# EAGLE design dummyload (EAGLE 6.3)
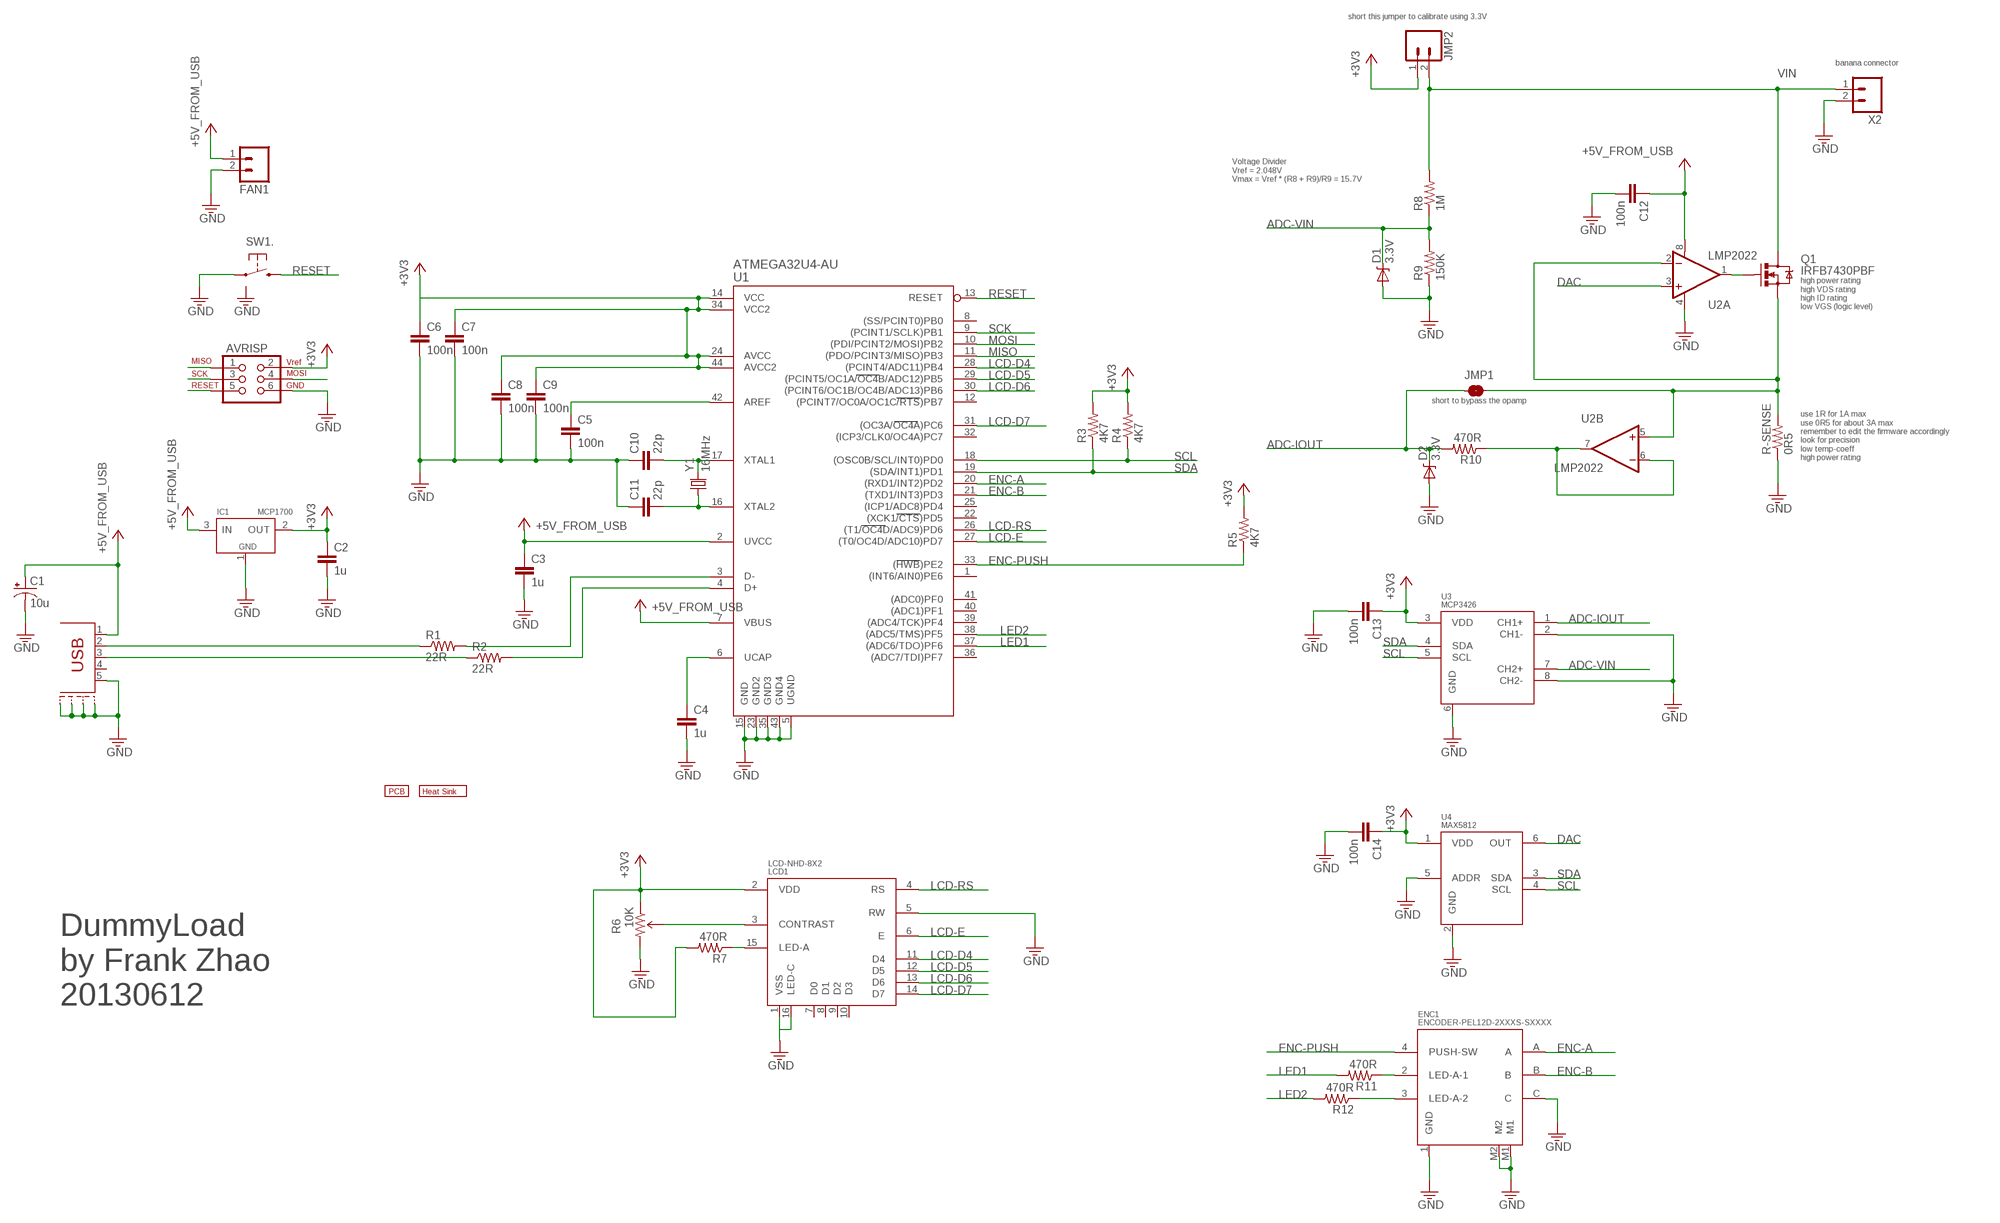
[diagram p0: schematic, sheet 1]

## Parts
AVRISP  AVR_SPI_PRG_62X3_LOCK  [2X3_LOCK]
C1  10u  CAP_POL1206-KIT  [EIA3216-KIT]
C2  1u  CAP0603-CAP  [0603-CAP]
C3  1u  CAP0603-CAP  [0603-CAP]
C4  1u  CAP0603-CAP  [0603-CAP]
C5  100n  CAP0603-CAP  [0603-CAP]
C6  100n  CAP0603-CAP  [0603-CAP]
C7  100n  CAP0603-CAP  [0603-CAP]
C8  100n  CAP0603-CAP  [0603-CAP]
C9  100n  CAP0603-CAP  [0603-CAP]
C10  22p  CAP0603-CAP  [0603-CAP]
C11  22p  CAP0603-CAP  [0603-CAP]
C12  100n  CAP0603-CAP  [0603-CAP]
C13  100n  CAP0603-CAP  [0603-CAP]
C14  100n  CAP0603-CAP  [0603-CAP]
D1  3.3V  DIODE-ZENER-SOD-123  [SOD-123]
D2  3.3V  DIODE-ZENER-SOD-123  [SOD-123]
ENC1  ENCODER-PEL12D-2XXXS-SXXXX  [ENCODER-PEL12D-2XXXS-SXXXX]
FAN1  M02PTH  [1X02]
IC1  MCP1700  VREG-MCP1700-SOT23-3  [SOT23-3]
JMP1  SOLDERJUMPERNO  [SJ_2S-NO]
JMP2  M02-2MM  [1X02_2MM]
LCD1  LCD-NHD-8X2  [LCD-NHD-8X2-HEADER]
Q1  IRFB7430PBF  MOSFET-NCHANNELPTH2  [TO220V]
R1  22R  RESISTOR0603-RES  [0603-RES]
R2  22R  RESISTOR0603-RES  [0603-RES]
R3  4K7  RESISTOR0603-RES  [0603-RES]
R4  4K7  RESISTOR0603-RES  [0603-RES]
R5  4K7  RESISTOR0603-RES  [0603-RES]
R6  10K  TRIMPOTSMD  [TRIMPOT-3MM]
R7  470R  RESISTOR0603-RES  [0603-RES]
R8  1M  RESISTOR0603-RES  [0603-RES]
R9  150K  RESISTOR0603-RES  [0603-RES]
R10  470R  RESISTOR0603-RES  [0603-RES]
R11  470R  RESISTOR0603-RES  [0603-RES]
R12  470R  RESISTOR0603-RES  [0603-RES]
R-SENSE  0R5  RESISTOR-D2PAK  [D2PACK]
SW1  SWITCH-B3U-1110-BOSS  [SWITCH-TACT-B3U-1100P-B]
U1  ATMEGA32U4-AU  [TQFP44]
U2  LMP2022  LMP20X2-MSOP8  [MSOP-8]
U3  MCP3426  MCP3426-MSOP8  [MSOP-8]
U4  MAX5812  MAX5812-SOT-23-6  [SOT23-6]
U$1  PCB-HAMMOND-RL6115  [PCB-HAMMOND-RL6115]
U$2  HEATSINK-TO220-VERT-42X25.4  [HEATSINK-TO220-VERT-42X25.4]
X1  USB-MINI/MICRO-4S-4LEGS  [USB_MICROB_4LEGS]
X2  M025MM  [SCREWTERMINAL-5MM-2]
Y1  16MHz  CRYSTAL5X3  [CRYSTAL-SMD-5X3]

## Nets
+3V3: AVRISP.2 C2.1 C6.1 C7.1 C8.1 C9.1 C13.1 C14.1 IC1.2(OUT) JMP2.1 LCD1.2(VDD) R3.2 R4.2 R5.2 R6.1(CCW) R7.2 U1.14(VCC) U1.24(AVCC) U1.34(VCC2) U1.44(AVCC2) U3.3(VDD) U4.1(VDD)
+5V_FROM_USB: C1.A(+) C3.1 C12.1 FAN1.1 IC1.3(IN) U1.2(UVCC) U1.7(VBUS) U2.8(A:V+) X1.1(VBUS)
ADC-IOUT: D2.C JMP1.1 R10.2 U3.1(CH1+)
ADC-VIN: D1.C R8.1 R9.2 U3.7(CH2+)
DAC: U2.3(A:+IN) U4.6(OUT)
ENC-A: ENC1.A U1.20((RXD1/INT2)PD2)
ENC-B: ENC1.B U1.21((TXD1/INT3)PD3)
ENC-PUSH: ENC1.4(PUSH-SW) R5.1 U1.33((HWB)PE2)
GND: AVRISP.6 C1.C(-) C2.2 C3.2 C4.2 C5.2 C6.2 C7.2 C8.2 C9.2 C10.1 C11.1 C12.2 C13.2 C14.2 D1.A D2.A ENC1.1(GND) ENC1.C ENC1.M1 ENC1.M2 FAN1.2 IC1.1(GND) LCD1.1(VSS) LCD1.5(RW) LCD1.16(LED-C) R6.3(CW) R9.1 R-SENSE.1 SW1.1 SW1.BOSS U1.5(UGND) U1.15(GND) U1.23(GND2) U1.35(GND3) U1.43(GND4) U2.4(A:V-) U3.2(CH1-) U3.6(GND) U3.8(CH2-) U4.2(GND) U4.5(ADDR) X1.5(GND) X1.P$3 X1.P$4 X1.P$7 X1.P$8 X2.2
LCD-D4: LCD1.11(D4) U1.28((PCINT4/ADC11)PB4)
LCD-D5: LCD1.12(D5) U1.29((PCINT5/OC1A/OC4B/ADC12)PB5)
LCD-D6: LCD1.13(D6) U1.30((PCINT6/OC1B/OC4B/ADC13)PB6)
LCD-D7: LCD1.14(D7) U1.31((OC3A/OC4A)PC6)
LCD-E: LCD1.6(E) U1.27((T0/OC4D/ADC10)PD7)
LCD-RS: LCD1.4(RS) U1.26((T1/OC4D/ADC9)PD6)
LED1: R11.2 U1.37((ADC6/TDO)PF6)
LED2: R12.2 U1.38((ADC5/TMS)PF5)
MISO: AVRISP.1 U1.11((PDO/PCINT3/MISO)PB3)
MOSI: AVRISP.4 U1.10((PDI/PCINT2/MOSI)PB2)
N$1: C4.1 U1.6(UCAP)
N$2: LCD1.15(LED-A) R7.1
N$3: C10.2 U1.17(XTAL1) Y1.3
N$4: LCD1.3(CONTRAST) R6.2(WIPER)
N$5: R1.1 X1.2(DM)
N$6: R2.1 X1.3(DP)
N$7: C11.2 U1.16(XTAL2) Y1.1
N$8: C5.1 U1.42(AREF)
N$9: JMP1.2 Q1.3(S) R-SENSE.3 U2.2(A:-IN) U2.5(B:+IN)
N$11: R1.2 U1.3(D-)
N$12: R2.2 U1.4(D+)
N$13: R10.1 U2.6(B:-IN) U2.7(B:OUT)
N$14: Q1.1(G) U2.1(A:OUT)
N$15: ENC1.2(LED-A-1) R11.1
N$16: ENC1.3(LED-A-2) R12.1
RESET: AVRISP.5 SW1.2 U1.13(RESET)
SCK: AVRISP.3 U1.9((PCINT1/SCLK)PB1)
SCL: R4.1 U1.18((OSC0B/SCL/INT0)PD0) U3.5(SCL) U4.4(SCL)
SDA: R3.1 U1.19((SDA/INT1)PD1) U3.4(SDA) U4.3(SDA)
VIN: JMP2.2 Q1.2(D) R8.2 X2.1
Unconnected: LCD1.7(D0) LCD1.8(D1) LCD1.9(D2) LCD1.10(D3) U1.1((INT6/AIN0)PE6) U1.8((SS/PCINT0)PB0) U1.12((PCINT7/OC0A/OC1C/RTS)PB7) U1.22((XCK1/CTS)PD5) U1.25((ICP1/ADC8)PD4) U1.32((ICP3/CLK0/OC4A)PC7) U1.36((ADC7/TDI)PF7) U1.39((ADC4/TCK)PF4) U1.40((ADC1)PF1) U1.41((ADC0)PF0) X1.4(ID)

## Notes on the sheet
- short this jumper to calibrate using 3.3V
- banana connector
- Voltage Divider
  Vref = 2.048V
  Vmax = Vref * (R8 + R9)/R9 = 15.7V
- high power rating
  high VDS rating
  high ID rating
  low VGS (logic level)
- short to bypass the opamp
- use 1R for 1A max
  use 0R5 for about 3A max
  remember to edit the firmware accordingly
  look for precision
  low temp-coeff
  high power rating
- DummyLoad
  by Frank Zhao
  20130612

## Library data of the parts
AVRISP = minilab:AVR_SPI_PRG_6: AVR ISP 6 Pin This is the reduced ISP connector for AVR programming. Common on Arduino. This footprint will take up less PCB space and can be used with a 10-pin to 6-pin adapter such as SKU: BOB-08508
C1 = minilab:CAP_POL: Capacitor Polarized These are standard SMD and PTH capacitors. Normally 10uF, 47uF, and 100uF in electrolytic and tantalum varieties. Always verify the external diameter of the through hole cap, it varies with capacity, voltage, and manufacturer. The EIA devices should be standard.
C2-C14 = minilab:CAP: Capacitor Standard 0603 ceramic capacitor, and 0.1" leaded capacitor.
D1 D2 = minilab:DIODE-ZENER: Zener Diode Production Part - 8199 3.4V Zener Voltage
ENC1 = minilab:ENCODER-PEL12D
FAN1 JMP2 X2 = minilab:M02: Header 2 Standard 2-pin 0.1" header. Use with straight break away headers (SKU : PRT-00116), right angle break away headers (PRT-00553), swiss pins (PRT-00743), machine pins (PRT-00117), and female headers (PRT-00115). Molex polarized connector foot print use with SKU : PRT-08233 with associated crimp pins and housings.
IC1 = minilab:VREG-MCP1700
JMP1 = minilab:SOLDERJUMPER: Solder Jumper Standard SMD solder jumper. Used to automate production. Two varients : Normally Open and Normally Closed are the same, but have different paste layers. NC will have a large amount of paste and should jumper during reflow.
LCD1 = minilab:LCD-NHD-8X2
Q1 = minilab:MOSFET-NCHANNEL
R1-R5 R7-R12 R-SENSE = minilab:RESISTOR: Resistor Basic schematic elements and footprints for 0603, 1206, and PTH resistors.
R6 = minilab:TRIMPOT
SW1 = minilab:SWITCH-B3U-1110
U1 = minilab:ATMEGA32U4-AU
U2 = minilab:LMP20X2
U3 = minilab:MCP3426
U4 = minilab:MAX5812
U$1 = minilab:PCB
U$2 = minilab:HEATSINK
X1 = minilab:USB-MINI/MICRO-4S
Y1 = minilab:CRYSTAL: Crystals Various standard crystals. Proven footprints. Spark Fun Electronics SKU : COM-00534

## Board
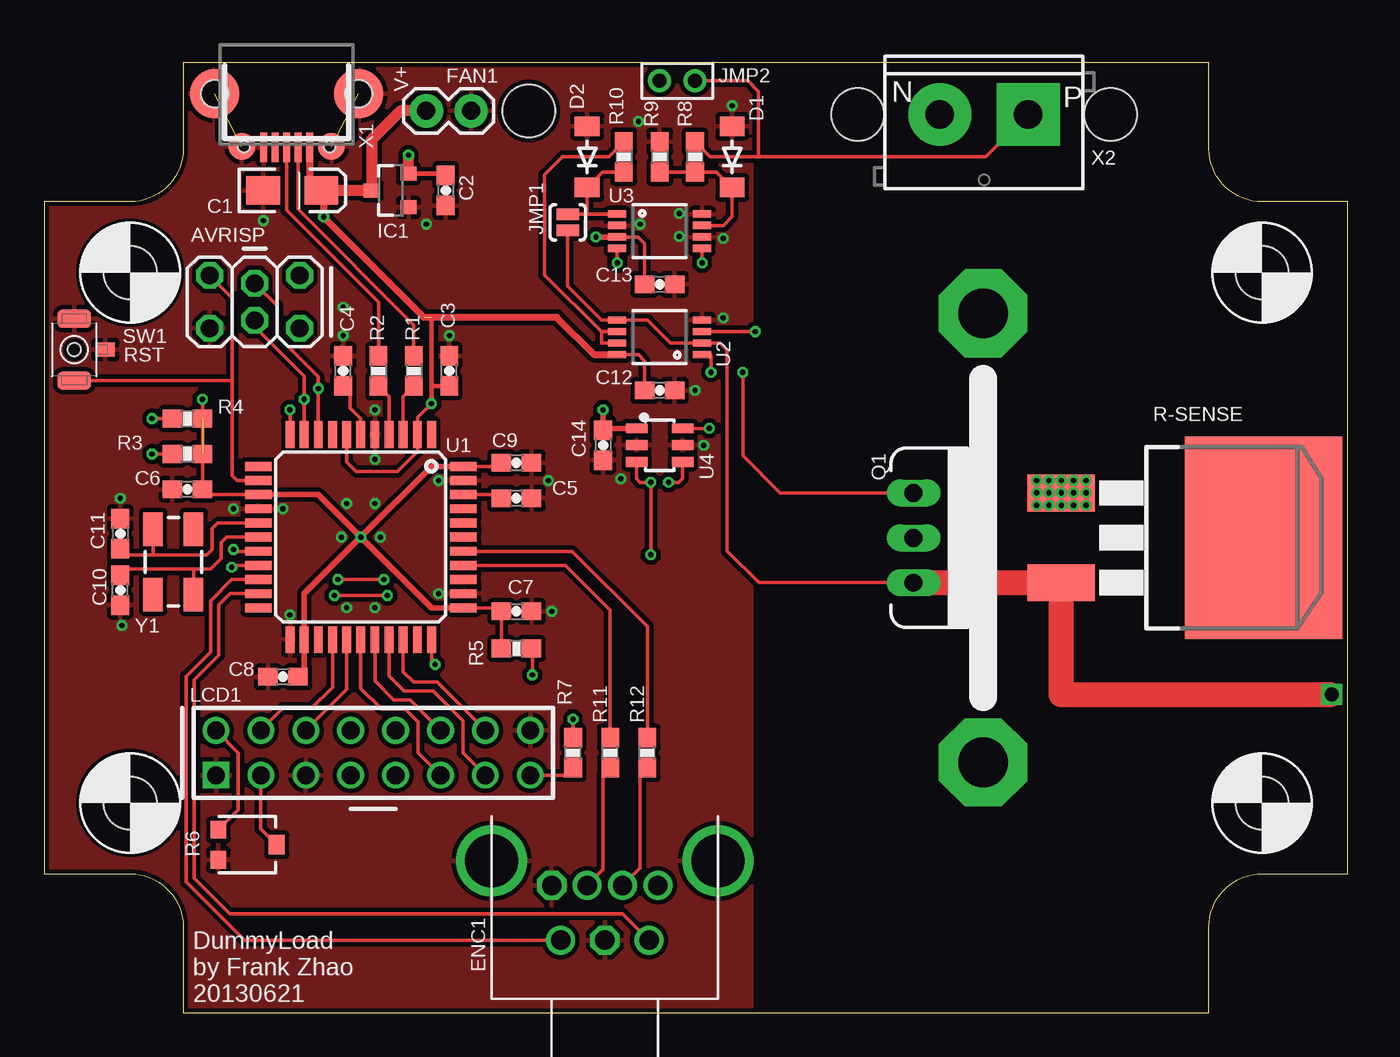
[diagram p1: board, top side]
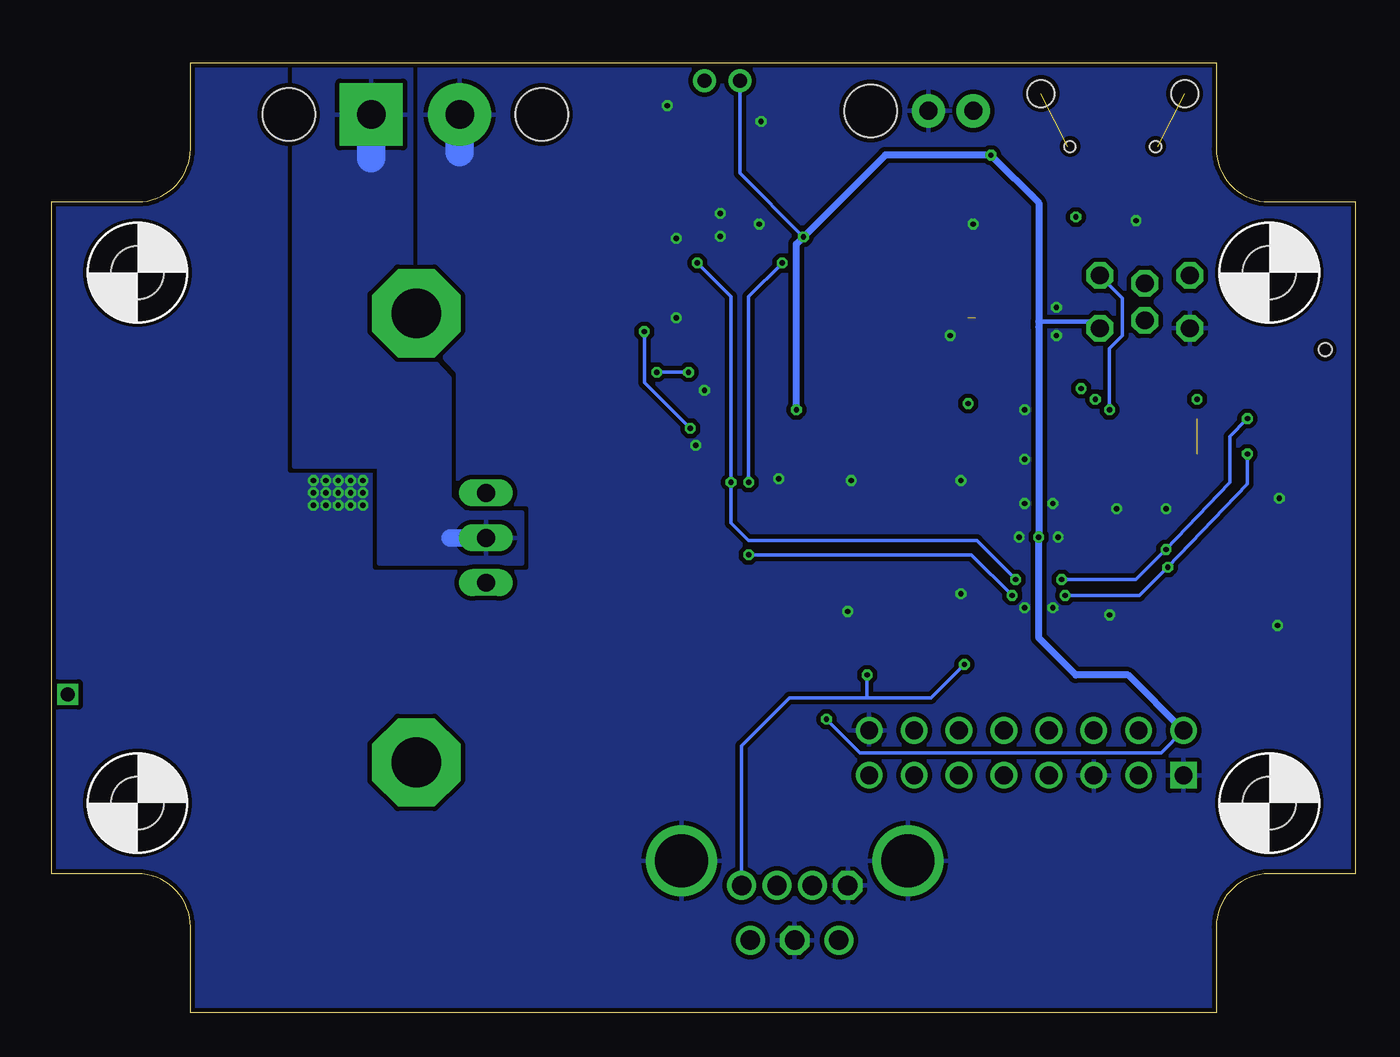
[diagram p2: board, bottom side, seen from below]

Size 73.72 x 53.72 mm. Coordinates in mm from the lower left corner, seen from the top.
Outline: 7.86,0 65.86,0 65.86,4.85 arc-90 68.87,7.86 73.72,7.86 73.72,45.86 68.87,45.86 arc-90 65.86,48.87 65.86,53.72 7.86,53.72 7.86,48.86 arc-90 4.86,45.86 0,45.86 0,7.86 4.86,7.86 arc-90 7.86,4.86 7.86,0
Copper layers (1*16): Top 0.035mm / dielectric 1.5mm / Bottom 0.035mm
Design rules "Fusion_eagle_rule_v1.1_TentedVias3": minimum track width 6mil, minimum drill 0.3mm, track to track 7mil, track to pad 7mil, pad to pad 7mil, via to via 7mil, smd to smd 0mil, copper to edge 10mil, drill to drill 10mil, minimum pad ring 10mil, minimum via ring 6mil, stop-mask expansion 2mil, vias tented up to drill 25mil, thermal gap 10mil
Holes 3 mm at 60.3,50.8 46,50.8 27.4,51

### Footprints (pad centres in the part's own frame; a part is rotated, then mirrored left to right if it is on the bottom)
2X3_LOCK = drill 1 octagon: 1 -2.54,-1.492; 2 -2.54,1.492; 3 0,-1.048; 4 0,1.048; 5 2.54,-1.492; 6 2.54,1.492
EIA3216-KIT = smd 1.9 x 1.6: A 1.65,0; C -1.65,0
0603-CAP = smd 1.1 x 1: 1 -0.85,0; 2 0.85,0
SOD-123 = smd 1.1 x 1.4: A -1.73,0; C 1.73,0
ENCODER-PEL12D-2XXXS-SXXXX = drill 1.1 octagon: 1 3,1.4; C 0,4.5 | drill 1.1: 2 1,1.4; 3 -1,1.4; 4 -3,1.4; A 2.5,4.5; B -2.5,4.5 | drill 3: M1 -6.4,0; M2 6.4,0
1X02 = drill 1.016 pad 1.88: 1 0,0; 2 2.54,0
SOT23-3 = smd 0.8 x 0.9: 1 -0.95,-1; 2 0.95,-1; 3 0,1.1
SJ_2S-NO = smd 0.635 x 1.27: 1 -0.45,0; 2 0.45,0
1X02_2MM = drill 0.8: 1 -1,0; 2 1,0
LCD-NHD-8X2-HEADER = drill 1 square: 1 -8.89,-1.27 | drill 1: 2 -8.89,1.27; 3 -6.35,-1.27; 4 -6.35,1.27; 5 -3.81,-1.27; 6 -3.81,1.27; 7 -1.27,-1.27; 8 -1.27,1.27; 9 1.27,-1.27; 10 1.27,1.27; 11 3.81,-1.27; 12 3.81,1.27; 13 6.35,-1.27; 14 6.35,1.27; 15 8.89,-1.27; 16 8.89,1.27
TO220V = drill 1.016 long: 1 -2.54,0; 2 0,0; 3 2.54,0
0603-RES = smd 1.1 x 1: 1 -0.85,0; 2 0.85,0
TRIMPOT-3MM = smd 1 x 0.9: 1 -0.85,-1.65; 3 0.85,-1.65 | smd 1.1 x 0.9: 2 0,1.65
D2PACK = smd 2.083 x 3.81: 1 -2.54,-8.89; 3 2.54,-8.89 | smd 11.43 x 8.89: 2 0,2.54
SWITCH-TACT-B3U-1100P-B = smd 1 x 1.9: 1 -1.75,0; 2 1.75,0 | smd 0.8 x 1.1: BOSS 0,1.75 | hole 0.762: 0,0
TQFP44 = smd 1.5 x 0.5: 1 -5.8,4; 2 -5.8,3.2; 3 -5.8,2.4; 4 -5.8,1.6; 5 -5.8,0.8; 6 -5.8,0; 7 -5.8,-0.8; 8 -5.8,-1.6; 9 -5.8,-2.4; 10 -5.8,-3.2; 11 -5.8,-4; 23 5.8,-4; 24 5.8,-3.2; 25 5.8,-2.4; 26 5.8,-1.6; 27 5.8,-0.8; 28 5.8,0; 29 5.8,0.8; 30 5.8,1.6; 31 5.8,2.4; 32 5.8,3.2; 33 5.8,4 | smd 0.5 x 1.5: 12 -4,-5.8; 13 -3.2,-5.8; 14 -2.4,-5.8; 15 -1.6,-5.8; 16 -0.8,-5.8; 17 0,-5.8; 18 0.8,-5.8; 19 1.6,-5.8; 20 2.4,-5.8; 21 3.2,-5.8; 22 4,-5.8; 34 4,5.8; 35 3.2,5.8; 36 2.4,5.8; 37 1.6,5.8; 38 0.8,5.8; 39 0,5.8; 40 -0.8,5.8; 41 -1.6,5.8; 42 -2.4,5.8; 43 -3.2,5.8; 44 -4,5.8
MSOP-8 = smd 0.41 x 1.02: 1 -0.975,-2.4; 2 -0.325,-2.4; 3 0.325,-2.4; 4 0.975,-2.4; 5 0.975,2.4; 6 0.325,2.4; 7 -0.325,2.4; 8 -0.975,2.4
SOT23-6 = smd 0.55 x 1.2: 1 0.95,1.3; 2 0,1.3; 3 -0.95,1.3; 4 -0.95,-1.3; 5 0,-1.3; 6 0.95,-1.3
PCB-HAMMOND-RL6115 = hole 3: 4.86,41.86; 68.86,41.86; 68.86,11.86; 4.86,11.86
HEATSINK-TO220-VERT-42X25.4 = drill 2.8 pad 5 octagon: M1 -12.7,0; M2 12.7,0
USB_MICROB_4LEGS = smd 0.4 x 1.651: 1 -1.3,3.048; 2 -0.65,3.048; 3 0,3.048; 4 0.65,3.048; 5 1.3,3.048 | smd 1.524 x 1.524: P$3 -2.54,3; P$4 2.54,3 | smd 2.794 x 2.794: P$7 -4.064,0; P$8 4.064,0 | hole 0.65: -2.425,3; 2.425,3 | hole 1.55: -4.064,0; 4.064,0
SCREWTERMINAL-5MM-2 = drill 1.6 pad 3.556 square: 1 -2.54,0 | drill 1.6 pad 3.556: 2 2.46,0
CRYSTAL-SMD-5X3 = smd 1.9 x 1.1: 1 -1.85,-1.15; 2 1.85,-1.15; 3 1.85,1.15; 4 -1.85,1.15

### Placement (x,y rotation side)
AVRISP  11.9,40.2 180 top
C1  14.03,46.5 0 top
C2  22.7,46.5 270 top
C3  22.9,36.3 90 top
C4  16.9,36.3 90 top
C5  26.7,29.1 0 top
C6  8.1,29.6 180 top
C7  26.7,22.7 0 top
C8  13.5,19 180 top
C9  26.7,31.1 0 top
C10  4.3,23.9 90 top
C11  4.3,27.1 270 top
C12  34.8,35.2 0 top
C13  34.8,41.2 0 top
C14  31.6,32.1 270 top
D1  38.9,48.4 270 top
D2  30.7,48.4 270 top
ENC1  31.7,8.6 180 top
FAN1  21.6,51 0 top
IC1  19.6,46.5 90 top
JMP1  29.6,44.7 270 top
JMP2  35.8,52.7 0 top
LCD1  18.6,14.7 0 top
Q1  49.15,26.86 270 top
R1  20.9,36.3 270 top
R2  18.9,36.3 270 top
R3  8.1,31.6 0 top
R4  8.1,33.6 0 top
R5  26.7,20.6 180 top
R6  11.5,9.5 270 top
R7  29.9,14.7 90 top
R8  36.8,48.4 90 top
R9  34.8,48.4 270 top
R10  32.77,48.4 270 top
R11  32,14.7 90 top
R12  34.1,14.7 90 top
R-SENSE  66.4,26.86 270 top
SW1  1.7,37.5 270 top
U1  17.9,26.9 270 top
U2  34.8,38.2 90 top
U3  34.8,44.2 270 top
U4  34.8,32.1 90 top
U$1  0,0 0 top
U$2  53.1,26.86 90 top
X1  13.71,51.98 180 top
X2  53.1,50.8 180 top
Y1  7.3,25.5 270 top

### Tracks (layer width: path | path; a pad name or v marks a point on that pad's centre or on a via)
+3V3  (via drill 0.3)  (1 unrouted)
  Top 0.203: U1.44 25.65,30.9 C9.1 | U1.34 25.65,22.9 C7.1 R5.2 | v29.9,16.6 R7.2 | U1.14 8.95,29.3 C6.1 R4.2 v8.95,34.7 | U3.3 33.58,43.88 33.95,43.5 C13.1 | LCD1.2 10.98,14.7 10.98,11.48 R6.1
  Top 0.254: IC1.2 22.7,47.45 C2.1
  Top 0.305: U1.14 15.5,29.3 v17.9,26.9 | U1.44 21.9,30.9 v17.9,26.9 | U1.34 21.9,22.9 v17.9,26.9 | v17.9,26.9 14.7,23.7 U1.24 14.7,19.35 C8.1 | v31.2,43.88 U3.3 | 31.6,33.05 v31.6,34.1 | U4.1 31.6,33.05 | 31.6,33.05 C14.1
  Top 0.61: IC1.2 v20.6,48.5
  Bottom 0.203: 17.9,38.71 17.9,38.8 | v29.9,16.6 28,14.7 10.98,14.7 LCD1.2 | JMP2.1 34.8,47.48 v31.2,43.88
  Bottom 0.254: AVRISP.2 14.83,39.1 17.9,39.1
  Bottom 0.406: v31.6,34.1 31.6,43.48 v31.2,43.88 26.57,48.5 v20.6,48.5 17.9,45.8 17.9,39.1 17.9,38.8 v17.9,26.9 17.9,21.2 15.8,19.1 12.84,19.1 LCD1.2
+5V_FROM_USB  (via drill 0.3)  (1 unrouted)
  Top 0.203: U1.7 17.1,31.14 17.64,30.6 19.97,30.6 21.1,31.73 U1.2 21.1,33.66 v21.89,34.45 | C3.1 | C12.1 33.95,36.87 33.59,37.23 U2.8
  Top 0.254: 21.89,39.33 21.89,35.45 | 21.89,35.45 v21.89,34.45 | C3.1 21.89,35.45
  Top 0.406: X1.1 15.01,47.17 C1.A 15.8,46.38 15.8,46 v15.8,45 21.48,39.33 28.98,39.33 31.07,37.23 U2.8
  Top 0.61: 15.8,46 15.8,46.5 IC1.3 18.5,49.36 20.14,51 FAN1.1
ADC-IOUT
  Top 0.203: R10.2 31.58,47.55 D2.C 30.7,45.17 | 32.2,45.17 U3.1 31.4,45.17 30.7,45.17 | JMP1.1 29.62,45.17 30.7,45.17
ADC-VIN
  Top 0.203: U3.7 38.4,44.52 38.9,45.03 D1.C 38.02,47.55 R8.1 R9.2
DAC  (via drill 0.3 pad 0.3)
  Top 0.203: v37.6,33.05 U4.6 | v40.2,38.52 U2.3
  Bottom 0.203: v37.6,33.05 40.05,35.5 40.2,35.65 v40.2,38.52
ENC-A
  Top 0.203: U1.20 10.6,24.5 9.4,23.3 9.4,20.4 8.03,19.03 8.03,7.41 11.34,4.1 ENC1.A
ENC-B
  Top 0.203: U1.21 10.51,23.7 9.87,23.06 9.87,20.21 8.49,18.83 8.49,7.6 10.49,5.6 32.7,5.6 ENC1.B
ENC-PUSH  (via drill 0.3)
  Top 0.203: U1.33 21.9,19.9 v22.1,19.7 | R5.1 27.6,20.55 v27.6,19.1
  Bottom 0.203: 27.6,17.8 24,17.8 v22.1,19.7 | v27.6,19.1 27.6,17.8 | 27.6,17.8 32,17.8 34.7,15.1 ENC1.4
GND  (via drill 0.3)  (2 unrouted)
  Bottom 1.6: X2.2 50.64,48.67
  other vias: 18.7,31.3 18.7,34.1 22.9,38.3 16.9,38.3 28.5,30.1 22.3,30.1 28.7,22.7 22.3,23.7 13.9,22.5 13.5,28.5 10.7,28.5 4.3,29.1 4.4,21.9 12.4,44.8 16.9,39.9 21.6,44.6 18.7,28.8 17.1,28.8 16.8,26.9 19,26.9 56.11,29.4 56.81,29.4 57.51,29.4 58.21,29.4 56.11,28.7 56.81,28.7 57.51,28.7 58.21,28.7 32.6,30.2 37.3,32.1 36.8,35.2 38.4,39.3 35.9,45.2 38.4,43.8 35.9,43.9 33.7,44.6 17.1,22.9 18.7,22.9 56.11,30.1 56.81,30.1 57.51,30.1 58.21,30.1 58.91,29.4 58.91,28.7 58.91,30.1 33.6,50.4 38.9,51.3
  pour Bottom (isolate 0.254, rank 2): 0,0 73.72,0 73.72,53.72 0,53.72
  pour Top (isolate 0.254): 0,0 40,0 40,53.72 0,53.72
LCD-D4
  Top 0.203: U1.28 17.9,18.35 19.08,17.17 20.42,17.17 21.13,16.46 21.13,14.71 LCD1.11
LCD-D5
  Top 0.203: LCD1.12 20.68,17.7 19.76,17.7 18.7,18.76 U1.29
LCD-D6
  Top 0.203: LCD1.13 23.68,14.7 23.68,16.51 21.99,18.2 20.36,18.2 19.5,19.06 U1.30
LCD-D7
  Top 0.203: LCD1.14 22.22,18.7 20.88,18.7 20.3,19.28 U1.31
LCD-E
  Top 0.203: U1.27 17.1,18.28 LCD1.6
LCD-RS
  Top 0.203: U1.26 16.3,18.4 15.1,17.2 13.48,17.2 LCD1.4
LED1
  Top 0.203: R11.2 32,22.78 29.48,25.3 U1.37
LED2
  Top 0.203: R12.2 34.1,21.85 29.85,26.1 U1.38
MISO  (via drill 0.3)
  Top 0.203: U1.11 v13.9,34.1
  Bottom 0.203: v13.9,34.1 13.9,37.56 13.17,38.29 13.17,40.42 AVRISP.1
MOSI  (via drill 0.3)
  Top 0.203: U1.10 v14.7,34.7 14.7,36.01 11.9,38.81 AVRISP.4
N$1
  Top 0.203: U1.6 17.9,33.6 17.3,34.2 17.3,35.05 C4.1
N$2
  Top 0.203: R7.1 29.48,13.43 LCD1.15
N$3
  Top 0.203: U1.17 10.32,26.9 10,26.58 10,25.7 9.4,25.1 8.45,25.1 | 8.45,25.1 4.3,25.1 C10.2 | Y1.3 8.45,25.1
N$4
  Top 0.203: R6.2 12.25,10.4 LCD1.3
N$5
  Top 0.203: X1.2 14.36,45.44 20.9,38.9 R1.1
N$6
  Top 0.203: X1.3 13.71,45.39 18.9,40.2 R2.1
N$7
  Top 0.203: U1.16 9.8,27.7 9.5,27.4 9.5,26.2 9.2,25.9 6.15,25.9 | 6.15,25.9 Y1.1 | 6.15,25.9 4.3,25.9 C11.2
N$8
  Top 0.203: U1.42 25.65,29.3 C5.1
N$9
  Top 0.203: Q1.3 40.4,24.32 38.6,26.12 38.6,37.49 38.21,37.88 U2.2 35.42,37.88 34.12,39.17 U2.5 31.52,39.17 29.6,41.1 JMP1.2
  Top 1.422: Q1.3 R-SENSE.3 57.51,18 72.71,18
N$10  (via drill 0.8)
  other vias: 72.8,18
N$11
  Top 0.203: U1.3 20.3,34.85 R1.2
N$12
  Top 0.203: U1.4 19.5,34.85 R2.2
N$13
  Top 0.203: R10.1 31.93,48.4 29.3,48.4 28.3,47.4 28.3,41.73 31.5,38.52 | 31.5,38.52 31.5,37.88 U2.7 | U2.6 31.5,38.52
N$14  (via drill 0.3 pad 0.3)
  Top 0.203: Q1.1 41.6,29.4 39.5,31.5 v39.5,36.23 | v37.7,36.23 37.7,37.23 U2.1
  Bottom 0.203: v39.5,36.23 v37.7,36.23
N$15
  Top 0.203: ENC1.2 31.6,8.1 31.6,13.45 R11.1
N$16
  Top 0.203: ENC1.3 33.7,8.2 33.7,13.45 R12.1
RESET
  Top 0.203: 10.63,35.75 10.63,30.39 10.92,30.1 U1.13 | 10.63,35.75 SW1.2 | 10.63,35.75 10.63,40.42 AVRISP.5
SCK  (via drill 0.3)
  Top 0.203: U1.9 v15.5,35.3 15.5,35.97 13.17,38.3 13.17,39.98 AVRISP.3
SCL  (via drill 0.3)
  Top 0.203: R4.1 v6.1,33.6 | U1.18 10.8,26.1 v10.7,26.2 | v16.6,24.5 v19.2,24.5 | v35.3,30 35.88,30 36.1,30.22 U4.4 | v37.2,42.4 U3.5
  Bottom 0.203: v6.1,33.6 7.1,32.6 7.1,30 v10.7,26.2 12.4,24.5 v16.6,24.5 | v19.2,24.5 21.4,26.7 34.3,26.7 35.3,27.7 v35.3,30 35.3,40.5 v37.2,42.4
SDA  (via drill 0.3)
  Top 0.203: R3.1 v6.1,31.6 | U1.19 10.7,25.3 v10.6,25.2 | v16.4,23.6 v19.4,23.6 | v34.3,25.9 v34.3,30 33.7,30 33.5,30.2 U4.3 | v32.4,42.4 U3.4
  Bottom 0.203: v6.1,31.6 6.1,29.9 v10.6,25.2 12.2,23.6 v16.4,23.6 | v34.3,30 34.3,40.5 v32.4,42.4 | v19.4,23.6 21.7,25.9 v34.3,25.9
VIN
  Top 0.203: X2.1 53.24,48.4 40.4,48.4 | 40.4,48.4 37.65,48.4 R8.2 | JMP2.2 39.79,52.7 40.4,52.09 40.4,48.4
  Bottom 1: Q1.2 51.19,26.86
  Bottom 1.6: X2.1 55.64,48.34
  pour Bottom (isolate 0.254): 47.1,25.4 55.2,25.4 55.2,30.9 60,30.9 60,53.7 53.4,53.7 53.4,38.2 51.2,35.9 51.2,29.11 50.39,28.3 47.1,28.3

### Text on the board
tPlace: V+ | N | P
tNames: RST | DummyLoad / by Frank Zhao / 20130621